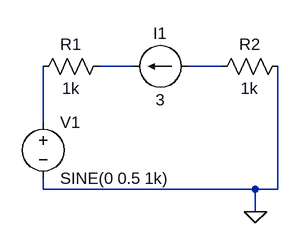
[diagram p0: schematic voltage_source_betw_node.asc]
voltage_source_betw_node.asc, the LTspice schematic file:
Version 4
SHEET 1 880 680
WIRE 176 64 128 64
WIRE 304 64 256 64
WIRE 48 144 48 64
WIRE 48 240 48 224
WIRE 352 240 48 240
WIRE 384 240 384 64
WIRE 384 240 352 240
WIRE 352 272 352 240
FLAG 352 272 0
SYMBOL voltage 48 128 R0
WINDOW 123 0 0 Left 0
WINDOW 39 0 0 Left 0
SYMATTR InstName V1
SYMATTR Value SINE(0 0.5 1k)
SYMBOL res 144 48 R90
WINDOW 0 0 56 VBottom 2
WINDOW 3 32 56 VTop 2
SYMATTR InstName R1
SYMATTR Value 1k
SYMBOL res 400 48 R90
WINDOW 0 0 56 VBottom 2
WINDOW 3 32 56 VTop 2
SYMATTR InstName R2
SYMATTR Value 1k
SYMBOL current 256 64 R90
WINDOW 0 -32 40 VBottom 2
WINDOW 3 32 40 VTop 2
SYMATTR InstName I1
SYMATTR Value 3

The netlist it stands for:
* voltage_source_betw_node.asc
V1 N003 0 SINE(0 0.5 1k)
R1 N001 N003 1k
R2 0 N002 1k
I1 N002 N001 3
.backanno
.end